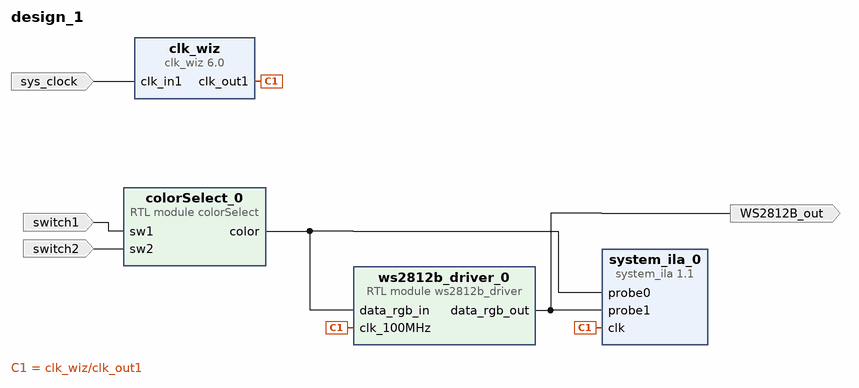
[diagram p0: block diagram of the top level]
# Vivado block design design_1, xc7z020clg400-1, Vivado 2019.2
create_bd_design design_1

create_bd_port -dir O WS2812B_out
create_bd_port -dir I switch1
create_bd_port -dir I switch2
create_bd_port -dir I -type clk sys_clock
set_property -dict {CONFIG.FREQ_HZ 125000000 CONFIG.PHASE 0.000} [get_bd_ports sys_clock]

create_bd_cell -type ip -vlnv xilinx.com:ip:clk_wiz:6.0 clk_wiz
set_property -dict [list \
  CONFIG.CLKOUT1_JITTER 124.615 \
  CONFIG.CLKOUT1_REQUESTED_OUT_FREQ 100.000 \
  CONFIG.CLK_IN1_BOARD_INTERFACE sys_clock \
  CONFIG.MMCM_CLKOUT0_DIVIDE_F 10.000 \
  CONFIG.USE_BOARD_FLOW true \
  CONFIG.USE_LOCKED false \
  CONFIG.USE_RESET false \
] [get_bd_cells clk_wiz]
create_bd_cell -type ip -vlnv xilinx.com:ip:system_ila:1.1 system_ila_0
set_property -dict [list \
  CONFIG.C_MON_TYPE NATIVE \
  CONFIG.C_NUM_OF_PROBES 2 \
  CONFIG.C_PROBE0_TYPE 0 \
  CONFIG.C_PROBE1_TYPE 0 \
] [get_bd_cells system_ila_0]
create_bd_cell -type module -reference colorSelect colorSelect_0
create_bd_cell -type module -reference ws2812b_driver ws2812b_driver_0
set_property -dict {CONFIG.LEDs 10} [get_bd_cells ws2812b_driver_0]

# ---- connections ----

connect_bd_net -net ws2812b_driver_0_data_rgb_out [get_bd_pins ws2812b_driver_0/data_rgb_out] \
  [get_bd_ports WS2812B_out] [get_bd_pins system_ila_0/probe1]
connect_bd_net -net colorSelect_0_color [get_bd_pins colorSelect_0/color] [get_bd_pins system_ila_0/probe0] [get_bd_pins ws2812b_driver_0/data_rgb_in]
connect_bd_net -net red_0_1 [get_bd_ports switch1] [get_bd_pins colorSelect_0/sw1]
connect_bd_net -net blue_0_1 [get_bd_ports switch2] [get_bd_pins colorSelect_0/sw2]
connect_bd_net [get_bd_pins clk_wiz/clk_out1] [get_bd_pins system_ila_0/clk] [get_bd_pins ws2812b_driver_0/clk_100MHz]
connect_bd_net [get_bd_ports sys_clock] [get_bd_pins clk_wiz/clk_in1]
set_property HDL_ATTRIBUTE.DEBUG true [get_bd_nets ws2812b_driver_0_data_rgb_out]
set_property HDL_ATTRIBUTE.MARK_DEBUG true [get_bd_nets ws2812b_driver_0_data_rgb_out]
set_property HDL_ATTRIBUTE.DEBUG true [get_bd_nets colorSelect_0_color]
set_property HDL_ATTRIBUTE.MARK_DEBUG true [get_bd_nets colorSelect_0_color]

validate_bd_design
save_bd_design
